# EAGLE schematic k1fm-pico-balloon-v1.0 (EAGLE 9.4.1)
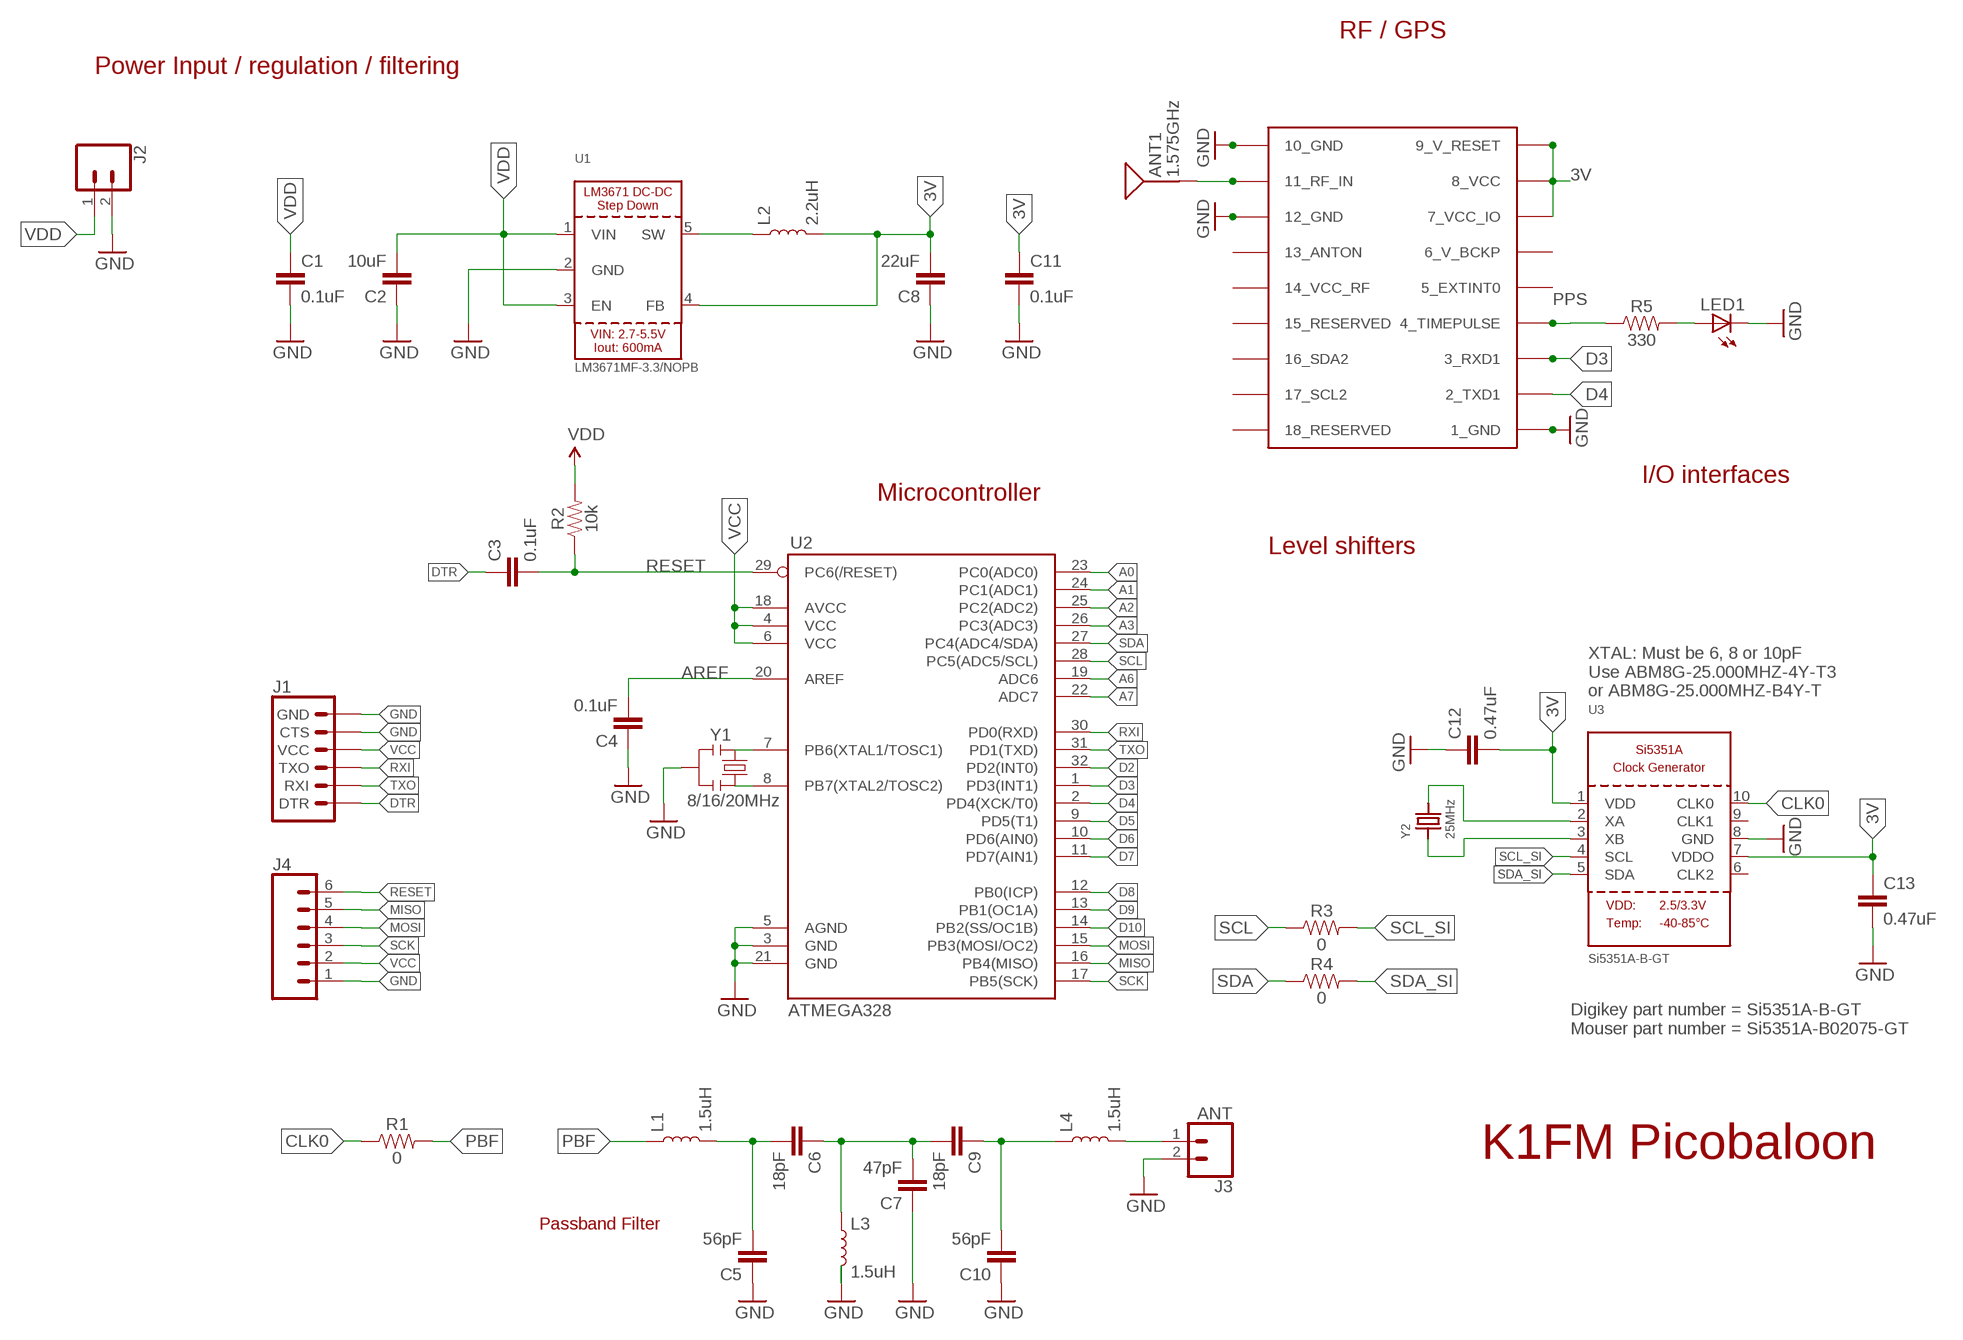
[diagram p0: schematic, sheet 1]

## Parts
ANT1  1.575GHz  ANTENNAGPS-2X7MM  [ANT-GPS-2X7MM]
C1  0.1uF  0.1UF-0603-25V-5%  [0603]
C2  10uF  10UF-0603-6.3V-20%  [0603]
C3  0.1uF  0.1UF-0603-25V-5%  [0603]
C4  0.1uF  0.1UF-0603-25V-5%  [0603]
C5  56pF  0.1UF-0603-25V-5%  [0603]
C6  18pF  0.1UF-0603-25V-5%  [0603]
C7  47pF  0.1UF-0603-25V-5%  [0603]
C8  22uF  10UF-0603-6.3V-20%  [0603]
C9  18pF  0.1UF-0603-25V-5%  [0603]
C10  56pF  0.1UF-0603-25V-5%  [0603]
C11  0.1uF  0.1UF-0603-25V-5%  [0603]
C12  0.47uF  0.1UF-0603-25V-5%  [0603]
C13  0.47uF  0.1UF-0603-25V-5%  [0603]
GPS1  UBLOX_MAX  [UBLOX_MAX]
J1  6_PIN_SERIAL_TARGET  [1X06]
J2  CONN_02  [1X02]
J3  ANT  CONN_02  [1X02]
J4  CONN_06SILK_FEMALE_PTH  [1X06]
L1  1.5uH  INDUCTOR-0603-33NH  [0603]
L2  2.2uH  INDUCTOR-0603-33NH  [0603]
L3  1.5uH  INDUCTOR-0603-33NH  [0603]
L4  1.5uH  INDUCTOR-0603-33NH  [0603]
LED1  LEDCHIP-LED0603  [CHIP-LED0603]
R1  0  0OHM-0603-1/10W-5%  [0603]
R2  10k  10KOHM-0603-1/10W-1%  [0603]
R3  0  0OHM-0603-1/10W-5%  [0603]
R4  0  0OHM-0603-1/10W-5%  [0603]
R5  330  330OHM-0603-1/10W-1%  [0603]
U1  LM3671MF-3.3/NOPB  VREG_LM3671  [SOT23-5]
U2  ATMEGA328  ATMEGA168  [TQFP32-08]
U3  Si5351A-B-GT  SI5351A  [MSOP10]
Y1  8/16/20MHz  RESONATOR1:1  [RESONATOR-SMD-1:1]
Y2  25MHz  CRYSTAL3.2X2.5  [CRYSTAL_3.2X2.5]

## Nets
3V: C8.2 C11.1 C12.2 GPS1.7_VCC_IO GPS1.8_VCC GPS1.9_V_RESET L2.2 U1.4(FB) U3.1(VDD)
A0: U2.23(PC0(ADC0))
A1: U2.24(PC1(ADC1))
A2: U2.25(PC2(ADC2))
A3: U2.26(PC3(ADC3))
A6: U2.19(ADC6)
A7: U2.22(ADC7)
ANT: J3.1 L4.2
AREF: C4.2 U2.20(AREF)
CLK0: R1.1 U3.10(CLK0)
D2: U2.32(PD2(INT0))
D3: GPS1.3_RXD1 U2.1(PD3(INT1))
D4: GPS1.2_TXD1 U2.2(PD4(XCK/T0))
D5: U2.9(PD5(T1))
D6: U2.10(PD6(AIN0))
D7: U2.11(PD7(AIN1))
D8: U2.12(PB0(ICP))
D9: U2.13(PB1(OC1A))
D10: U2.14(PB2(SS/OC1B))
DTR: C3.1 J1.1(DTR)
GND: C1.2 C2.1 C4.1 C5.1 C7.1 C8.1 C10.1 C11.2 C12.1 C13.2 GPS1.1_GND GPS1.10_GND GPS1.12_GND J1.5(CTS) J1.6(GND) J2.2 J3.2 J4.1 L3.2 LED1.C U1.2(GND) U2.3(GND) U2.5(AGND) U2.21(GND) U3.8(GND) Y1.2
MISO: J4.5 U2.16(PB4(MISO))
MOSI: J4.4 U2.15(PB3(MOSI/OC2))
N$1: C13.1 U3.7(VDDO)
N$3: LED1.A R5.2
N$6: ANT1.1(SIGNAL) GPS1.11_RF_IN
N$8: L2.1 U1.5(SW)
N$9: C6.1 C7.2 C9.2 L3.1
N$12: C5.2 C6.2 L1.2
N$13: C9.1 C10.2 L4.1
N$14: U3.3(XB) Y2.1
N$17: U3.2(XA) Y2.2
N$28: U2.8(PB7(XTAL2/TOSC2)) Y1.3
N$29: U2.7(PB6(XTAL1/TOSC1)) Y1.1
PBF: L1.1 R1.2
PPS: GPS1.4_TIMEPULSE R5.1
RESET: C3.2 J4.6 R2.1 U2.29(PC6(/RESET))
RXI: J1.3(TXO) U2.30(PD0(RXD))
SCK: J4.3 U2.17(PB5(SCK))
SCL: R3.1 U2.28(PC5(ADC5/SCL))
SCL_SI: R3.2 U3.4(SCL)
SDA: R4.1 U2.27(PC4(ADC4/SDA))
SDA_SI: R4.2 U3.5(SDA)
TXO: J1.2(RXI) U2.31(PD1(TXD))
VCC: J1.4(VCC) J4.2 R2.2 U2.4(VCC) U2.6(VCC) U2.18(AVCC) ; supply symbol labelled VDD
VDD: C1.1 C2.2 J2.1 U1.1(VIN) U1.3(EN)
Unconnected: GPS1.5_EXTINT0 GPS1.6_V_BCKP GPS1.13_ANTON GPS1.14_VCC_RF GPS1.15_RESERVED GPS1.16_SDA2 GPS1.17_SCL2 GPS1.18_RESERVED U3.6(CLK2) U3.9(CLK1)

## Notes on the sheet
- RF / GPS
- Power Input / regulation / filtering
- I/O interfaces
- Microcontroller
- Level shifters
- XTAL: Must be 6, 8 or 10pF
  Use ABM8G-25.000MHZ-4Y-T3
  or ABM8G-25.000MHZ-B4Y-T
- Digikey part number = Si5351A-B-GT
  Mouser part number = Si5351A-B02075-GT
- K1FM Picobaloon
- Passband Filter

## Library data of the parts
ANT1 = SparkFun-GPS:ANTENNA: Single-ended Antennae 1.575GHz antennae with just one terminal. These are all chip antennae. 1575MHz (GPS) Antennae ANT-GPS-2X7MM - 2.0 x 7.0 mm chip antenna. (SparkFun Product <https://www.sparkfun.com/products/9131>) ANT-GPS-2X8MM - 2.0 x 8.0 mm chip antenna. (SparkFun Product <https://www.sparkfun.com/products/8418>); PROD_ID: ANT-09087; SF_ID: GPS-09131
C1 C3 C4 C11 = SparkFun-Capacitors:0.1UF: 0.1µF ceramic capacitors A capacitor is a passive two-terminal electrical component used to store electrical energy temporarily in an electric field.; PROD_ID: CAP-08604
C2 = SparkFun-Capacitors:10UF: 10.0µF ceramic capacitors A capacitor is a passive two-terminal electrical component used to store electrical energy temporarily in an electric field.; PROD_ID: CAP-11015
C5-C7 C9 C10 C12 C13 = SparkFun-Capacitors:0.1UF: 0.1µF ceramic capacitors A capacitor is a passive two-terminal electrical component used to store electrical energy temporarily in an electric field.; PROD_ID: CAP-08604; VALUE: 0.1uF
C8 = SparkFun-Capacitors:10UF: 10.0µF ceramic capacitors A capacitor is a passive two-terminal electrical component used to store electrical energy temporarily in an electric field.; PROD_ID: CAP-11015; VALUE: 10uF
GPS1 = Ava:UBLOX_MAX: UBLOX MAX
J1 = SparkFun-Connectors:6_PIN_SERIAL_TARGET: 6-pin header connection for use with the "FTDI BASIC" pinout - TARGET SIDE. Also known as "Arduino Serial Program Header". It is used to mate with our FTDI Basic serial programmers using the Arduino IDE. Note, this device has "TARGET" in the name. It is intended to be used on a design that contains a target micro-controller that you wish to program. The "sister" device, named "CABLE" is inteneded to be used on a design that usually lives on the end of your USB cable and prvides the converter chip (FTDI232 or FTDI231x) to commnicate serial RX/TX. You can populate with some of these: Break Away Headers - Straight <https://www.sparkfun.com/products/116> (PRT-00116) For reference (or to suit your programming needs) check out these designs: SparkFun FTDI Basic Breakout - 5V <https://www.sparkfun.com/products/9716> (DEV-09716) SparkFun FTDI Basic Breakout - 3.3V <https://www.sparkfun.com/products/9873> (DEV-09873) SparkFun FTDI SmartBasic <https://www.sparkfun.com/products/12935> (DEV-12935) SparkFun Beefy 3 - FTDI Basic Breakout <https://www.sparkfun.com/products/13746> (DEV-13746)
J2 J3 = SparkFun-Connectors:CONN_02: Multi connection point. Often used as Generic Header-pin footprint for 0.1 inch spaced/style header connections On any of the 0.1 inch spaced packages, you can populate with these: Break Away Headers - Straight <https://www.sparkfun.com/products/116> (PRT-00116) Break Away Male Headers - Right Angle <https://www.sparkfun.com/products/553> (PRT-00553) Female Headers <https://www.sparkfun.com/products/115> (PRT-00115) Break Away Headers - Machine Pin <https://www.sparkfun.com/products/117> (PRT-00117) Break Away Female Headers - Swiss Machine Pin <https://www.sparkfun.com/products/743> (PRT-00743) For SCREWTERMINALS and SPRING TERMINALS visit here: Screw Terimnals on SparkFun.com <https://www.sparkfun.com/search/results?term=Screw+Terminals> (5mm/3.5mm/2.54mm spacing) This device is also useful as a general connection point to wire up your design to another part of your project. Our various solder wires solder well into these plated through hole pads. Hook-Up Wire - Assortment (Stranded, 22 AWG) <https://www.sparkfun.com/products/11375> (PRT-11375) Hook-Up Wire - Assortment (Solid Core, 22 AWG) <https://www.sparkfun.com/products/11367> (PRT-11367) View the entire wire category on our website here <https://www.sparkfun.com/categories/141> Special notes: Molex polarized connector foot print use with: PRT-08233 with associated crimp pins and housings. 2.54_SCREWTERM for use with PRT-10571. 3.5mm Screw Terminal footprints for PRT-08084 5mm Screw Terminal footprints for use with PRT-08432
J4 = SparkFun-Connectors:CONN_06: Multi connection point. Often used as Generic Header-pin footprint for 0.1 inch spaced/style header connections On any of the 0.1 inch spaced packages, you can populate with these: Break Away Headers - Straight <https://www.sparkfun.com/products/116> (PRT-00116) Break Away Male Headers - Right Angle <https://www.sparkfun.com/products/553> (PRT-00553) Female Headers <https://www.sparkfun.com/products/115> (PRT-00115) Break Away Headers - Machine Pin <https://www.sparkfun.com/products/117> (PRT-00117) Break Away Female Headers - Swiss Machine Pin <https://www.sparkfun.com/products/743> (PRT-00743) Arduino Stackable Header - 6 Pin <https://www.sparkfun.com/products/9280> (PRT-09280) For SCREWTERMINALS and SPRING TERMINALS visit here: Screw Terimnals on SparkFun.com <https://www.sparkfun.com/search/results?term=Screw+Terminals> (5mm/3.5mm/2.54mm spacing) This device is also useful as a general connection point to wire up your design to another part of your project. Our various solder wires solder well into these plated through hole pads. Hook-Up Wire - Assortment (Stranded, 22 AWG) <https://www.sparkfun.com/products/11375> (PRT-11375) Hook-Up Wire - Assortment (Solid Core, 22 AWG) <https://www.sparkfun.com/products/11367> (PRT-11367) View the entire wire category on our website here <https://www.sparkfun.com/categories/141>; PROD_ID: CONN-08437
L1-L4 = SparkFun-Coils:INDUCTOR: Inductors Resist changes in electrical current. Basically a coil of wire. SparkFun Products: SparkFun Load Cell Amplifier - HX711 <https://www.sparkfun.com/products/13879> IOIO-OTG - V2.2 <https://www.sparkfun.com/products/13613>; PROD_ID: NDUC-07874; VALUE: 33nH/±5%/500mA
LED1 = adafruit:LED: LED OSRAM: - CHIPLED LG R971, LG N971, LY N971, LG Q971, LY Q971, LO R971, LY R971 LH N974, LH R974 LS Q976, LO Q976, LY Q976 LO Q996 - Hyper CHIPLED LW Q18S LB Q993, LB Q99A, LB R99A - SideLED LS A670, LO A670, LY A670, LG A670, LP A670 LB A673, LV A673, LT A673, LW A673 LH A674 LY A675 LS A676, LA A676, LO A676, LY A676, LW A676 LS A679, LY A679, LG A679 - Hyper Micro SIDELED® LS Y876, LA Y876, LO Y876, LY Y876 LT Y87S - SmartLED LW L88C, LW L88S LB L89C, LB L89S, LG L890 LS L89K, LO L89K, LY L89K LS L896, LA L896, LO L896, LY L896 - TOPLED LS T670, LO T670, LY T670, LG T670, LP T670 LSG T670, LSP T670, LSY T670, LOP T670, LYG T670 LG T671, LOG T671, LSG T671 LB T673, LV T673, LT T673, LW T673 LH T674 LS T676, LA T676, LO T676, LY T676, LB T676, LH T676, LSB T676, LW T676 LB T67C, LV T67C, LT T67C, LS T67K, LO T67K, LY T67K, LW E67C LS E67B, LA E67B, LO E67B, LY E67B, LB E67C, LV E67C, LT E67C LW T67C LS T679, LY T679, LG T679 LS T770, LO T770, LY T770, LG T770, LP T770 LB T773, LV T773, LT T773, LW T773 LH T774 LS E675, LA E675, LY E675, LS T675 LS T776, LA T776, LO T776, LY T776, LB T776 LHGB T686 LT T68C, LB T68C - Hyper Mini TOPLED® LB M676 - Mini TOPLED Santana® LG M470 LS M47K, LO M47K, LY M47K Source: http://www.osram.convergy.de/
R1 R3 R4 = SparkFun-Resistors:0OHM: 0Ω resistor A resistor is a passive two-terminal electrical component that implements electrical resistance as a circuit element. Resistors act to reduce current flow, and, at the same time, act to lower voltage levels within circuits. - Wikipedia; PROD_ID: RES-08609
R2 = SparkFun-Resistors:10KOHM: 10kΩ resistor A resistor is a passive two-terminal electrical component that implements electrical resistance as a circuit element. Resistors act to reduce current flow, and, at the same time, act to lower voltage levels within circuits. - Wikipedia; PROD_ID: RES-00824
R5 = SparkFun-Resistors:330OHM: 330Ω resistor A resistor is a passive two-terminal electrical component that implements electrical resistance as a circuit element. Resistors act to reduce current flow, and, at the same time, act to lower voltage levels within circuits. - Wikipedia; PROD_ID: RES-00818
U1 = microbuilder:VREG_LM3671: LM3671 - 600mA DC-DC Step-Down Converter VIN: 2.7-5.5V Load Current: 600mA Switching Frequency: 2MHz Iq: 16uA
U2 = SparkFun:ATMEGA168
U3 = microbuilder:SI5351A: Si5351A 8kHz-160MHz I2C Clock Generator VDD: 2.5V or 3.3V Input Range: 25MHz or 27MHz XTAL User selectable internal input load capacitors: 6, 8 or 10 pF Output Impedance: 85 Ohm Output Load Capacitance: 5-15pF Operating Temperature: -40°C - 85°C Operating Current (3 outputs): 35mA Output buffer voltage (VDDO): 1.8, 2.5 or 3.3V Note: If VDDO is not used it should be connected to VDD. Unused clock out pins should be left floating.
Y1 = Testing:RESONATOR: Resonator Small SMD resonator. This is the itty bitty 10/20MHz resonators with built in caps. CSTCE10M0G55 and CSTCE20M0V53. Footprint for SMD has been used in SFE production for years, and does work okay. 1:1 is an attempt to get larger fillets on the sides so it will be easier to inspect these solders in our AOI machine. The pads have been minimized to match the actual metal under the resonator. To see this relation, it includes an image import of the bottom side of the component. Imported to scale on layer 200.
Y2 = microbuilder:CRYSTAL: Crystals HC49UP - Surface Mount Crystal 4.0MHz 18pF +/-30ppm Surface Mount Crystal [Digikey: 535-9857-1-ND] 12.0 MHz Surface Mount Crystal [Digikey: 535-9869-6-ND] 25.0 MHz Surface Mount Crystal [Digikey: 535-9078-1-ND] 2.5 x 2.0mm - MEMs SMT Crystal 16.0 MHz 10pF 20ppm 2.5 x 2.0mm Crystal [Digikey -40-85°C: 535-10923-1-ND] 3.2 x 2.5mm - MEMs SMT Crystal 12.0 MHz 8pF 15ppm 3.2 x 2.5mm Crystal [Digikey: -10-70°C: 644-1047-1-ND -40-125°C: 644-1128-1-ND] 40~85°C cheaper: 644-1173-6-ND 16.0 MHz 8pF 15ppm 3.2 x 2.5mm Crystal [Digikey: -10-70°C: 644-1049-1-ND -40-125°C: 644-1129-2-ND]-40~85°C cheaper: 644-1175-6-ND 16.0 MHz 10pF 10ppm 3.2 x 2.5mm Crystal [Digikey: 644-1100-1-ND] 27.12 MHz 18pF 30ppm 3.2 x 2.5mm Crystal [Digikey: 887-1424-1-ND] 27.12MHz 10pF 10ppm 3.2 x 2.5mm Crystal [Digikey: 887-1329-1-ND] 4.9 x 1.8mm - MEMs SMT Crystal 32.768 KHz 12.5pF 20ppm 4.9 x 1.8mm Crystal [Digikey: SE2415CT-ND] 8.0 x 3.8mm - Surface Mount Crystal 32.768kHz 12.5pF 20ppm -40°C-85°C [Digikey: 535-9166-2-ND] Cylinder 32.768KHz Cylinder Crystal (2x6mm body) [Ex. Digikey: 300-8341-2-ND]

## Net classes
1 vcc: width 0.254 mm